# EAGLE schematic breadboard (EAGLE 6.2)
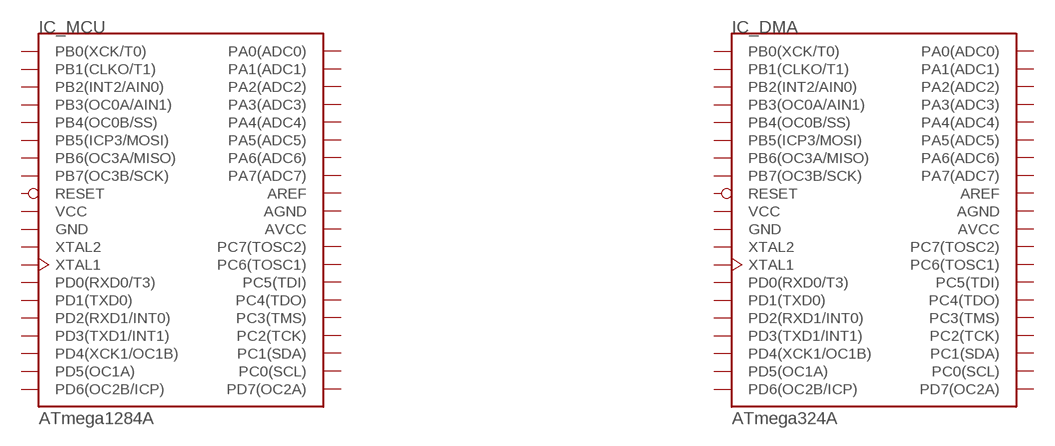
[diagram p0: schematic, sheet 1]

## Parts
IC_DMA  ATmega324A  ATMEGAXX4  [DIL40]
IC_MCU  ATmega1284A  ATMEGAXX4  [DIL40]
Unconnected: IC_DMA.1(PB0(XCK/T0)) IC_DMA.2(PB1(CLKO/T1)) IC_DMA.3(PB2(INT2/AIN0)) IC_DMA.4(PB3(OC0A/AIN1)) IC_DMA.5(PB4(OC0B/SS)) IC_DMA.6(PB5(ICP3/MOSI)) IC_DMA.7(PB6(OC3A/MISO)) IC_DMA.8(PB7(OC3B/SCK)) IC_DMA.9(RESET) IC_DMA.12(XTAL2) IC_DMA.13(XTAL1) IC_DMA.14(PD0(RXD0/T3)) IC_DMA.15(PD1(TXD0)) IC_DMA.16(PD2(RXD1/INT0)) IC_DMA.17(PD3(TXD1/INT1)) IC_DMA.18(PD4(XCK1/OC1B)) IC_DMA.19(PD5(OC1A)) IC_DMA.20(PD6(OC2B/ICP)) IC_DMA.21(PD7(OC2A)) IC_DMA.22(PC0(SCL)) IC_DMA.23(PC1(SDA)) IC_DMA.24(PC2(TCK)) IC_DMA.25(PC3(TMS)) IC_DMA.26(PC4(TDO)) IC_DMA.27(PC5(TDI)) IC_DMA.28(PC6(TOSC1)) IC_DMA.29(PC7(TOSC2)) IC_DMA.32(AREF) IC_DMA.33(PA7(ADC7)) IC_DMA.34(PA6(ADC6)) IC_DMA.35(PA5(ADC5)) IC_DMA.36(PA4(ADC4)) IC_DMA.37(PA3(ADC3)) IC_DMA.38(PA2(ADC2)) IC_DMA.39(PA1(ADC1)) IC_DMA.40(PA0(ADC0)) IC_MCU.1(PB0(XCK/T0)) IC_MCU.2(PB1(CLKO/T1)) IC_MCU.3(PB2(INT2/AIN0)) IC_MCU.4(PB3(OC0A/AIN1)) IC_MCU.5(PB4(OC0B/SS)) IC_MCU.6(PB5(ICP3/MOSI)) IC_MCU.7(PB6(OC3A/MISO)) IC_MCU.8(PB7(OC3B/SCK)) IC_MCU.9(RESET) IC_MCU.12(XTAL2) IC_MCU.13(XTAL1) IC_MCU.14(PD0(RXD0/T3)) IC_MCU.15(PD1(TXD0)) IC_MCU.16(PD2(RXD1/INT0)) IC_MCU.17(PD3(TXD1/INT1)) IC_MCU.18(PD4(XCK1/OC1B)) IC_MCU.19(PD5(OC1A)) IC_MCU.20(PD6(OC2B/ICP)) IC_MCU.21(PD7(OC2A)) IC_MCU.22(PC0(SCL)) IC_MCU.23(PC1(SDA)) IC_MCU.24(PC2(TCK)) IC_MCU.25(PC3(TMS)) IC_MCU.26(PC4(TDO)) IC_MCU.27(PC5(TDI)) IC_MCU.28(PC6(TOSC1)) IC_MCU.29(PC7(TOSC2)) IC_MCU.32(AREF) IC_MCU.33(PA7(ADC7)) IC_MCU.34(PA6(ADC6)) IC_MCU.35(PA5(ADC5)) IC_MCU.36(PA4(ADC4)) IC_MCU.37(PA3(ADC3)) IC_MCU.38(PA2(ADC2)) IC_MCU.39(PA1(ADC1)) IC_MCU.40(PA0(ADC0))

## Power pins joined to a net without a drawn wire
AGND: IC_DMA.31(AGND) IC_MCU.31(AGND)
AVCC: IC_DMA.30(AVCC) IC_MCU.30(AVCC)
GND: IC_DMA.11(GND) IC_MCU.11(GND)
VCC: IC_DMA.10(VCC) IC_MCU.10(VCC)

## Library data of the parts
IC_DMA IC_MCU = chips:ATMEGAXX4: ATmegaXX4 ATmega164 ATmega324 ATmega644 ATmega1284